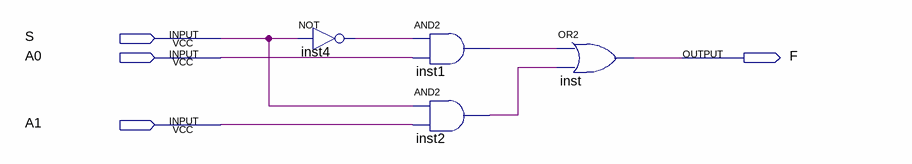
[diagram p0: schematic sheet]
// Quartus schematic MUX_2-1_1BIT.bdf as structural Verilog: 4 symbols, 4 pins
module \MUX_2-1_1BIT  (
  input  S,
  input  A0,
  input  A1,
  output F
);

  wire inst1_out, inst2_out, inst4_out;

  not inst4 (inst4_out, S);
  and inst1 (inst1_out, inst4_out, A0);
  and inst2 (inst2_out, S, A1);
  or inst (F, inst1_out, inst2_out);
endmodule
